# Altium schematic sheet Switches.SchDoc
size Letter
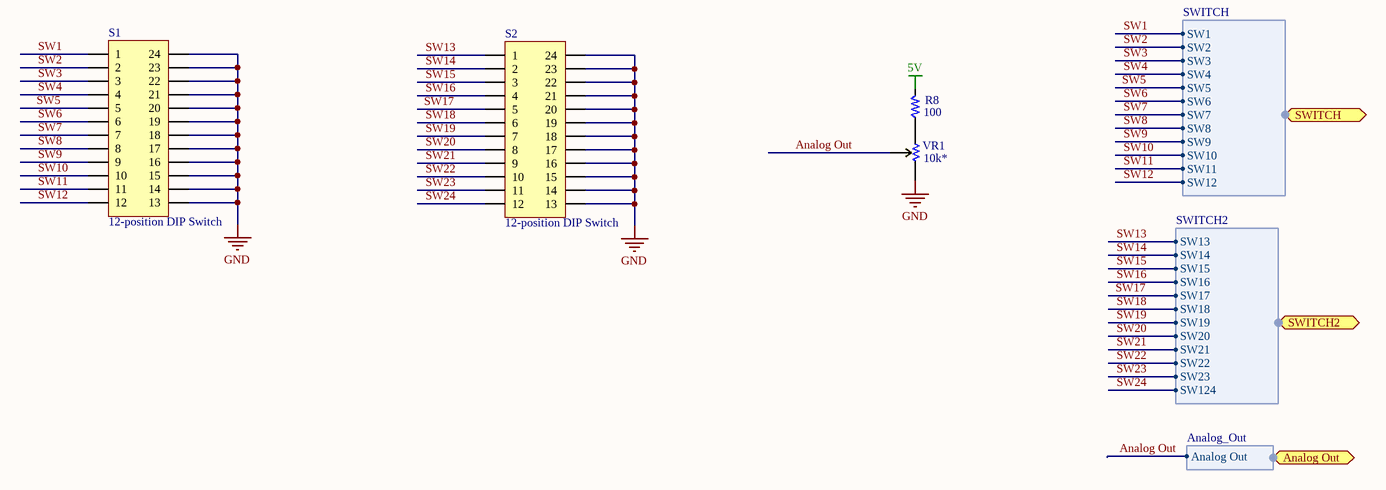
[diagram p0: Switches.SchDoc]

## Parts
R8  Resistance: 100  [PCB_GENERIC_SMD_0603]  (hidden comment: SCH_GENERIC_RESISTOR_0603)
S1  12-position DIP Switch  [12-Position DIP Switch]
S2  12-position DIP Switch  [12-Position DIP Switch]
VR1  10k*  [Rotary Pot]

## Ports
Analog Out (harness Analog_Out), SWITCH2 (harness SWITCH2), SWITCH (harness SWITCH)

## Harnesses
SWITCH: SW1, SW2, SW3, SW4, SW5, SW6, SW7, SW8, SW9, SW10, SW11, SW12
Analog_Out: Analog Out
SWITCH2: SW13, SW14, SW15, SW16, SW17, SW18, SW19, SW20, SW21, SW22, SW23, SW124

## Nets
5V: R8.2
GND: S1.13 S1.14 S1.15 S1.16 S1.17 S1.18 S1.19 S1.20 S1.21 S1.22 S1.23 S1.24 S2.13 S2.14 S2.15 S2.16 S2.17 S2.18 S2.19 S2.20 S2.21 S2.22 S2.23 S2.24 VR1.3
Analog Out: VR1.2 ; port Analog Out.Analog Out
SW1: S1.1 ; port SWITCH.SW1
SW2: S1.2 ; port SWITCH.SW2
SW3: S1.3 ; port SWITCH.SW3
SW4: S1.4 ; port SWITCH.SW4
SW5: S1.5 ; port SWITCH.SW5
SW6: S1.6 ; port SWITCH.SW6
SW7: S1.7 ; port SWITCH.SW7
SW8: S1.8 ; port SWITCH.SW8
SW9: S1.9 ; port SWITCH.SW9
SW10: S1.10 ; port SWITCH.SW10
SW11: S1.11 ; port SWITCH.SW11
SW12: S1.12 ; port SWITCH.SW12
SW13: S2.1 ; port SWITCH2.SW13
SW14: S2.2 ; port SWITCH2.SW14
SW15: S2.3 ; port SWITCH2.SW15
SW16: S2.4 ; port SWITCH2.SW16
SW17: S2.5 ; port SWITCH2.SW17
SW18: S2.6 ; port SWITCH2.SW18
SW19: S2.7 ; port SWITCH2.SW19
SW20: S2.8 ; port SWITCH2.SW20
SW21: S2.9 ; port SWITCH2.SW21
SW22: S2.10 ; port SWITCH2.SW22
SW23: S2.11 ; port SWITCH2.SW23
SW24: S2.12 ; port SWITCH2.SW124
NetR8_1: R8.1 VR1.1

## Library data of the parts
R8 = SCH_GENERIC_RESISTOR_0603: Generic SMD resistor 0603
S1 S2 = 12-position DIP Switch: Manufacturer: CTS Electronics; Manufacturer No.: 209-12LPST
VR1 = Rotary Pot: Manufacturer: CTS Electronics; Manufacturer ID: 296UD103B1N; Max Resistance: 10k; Tolerance: 20%